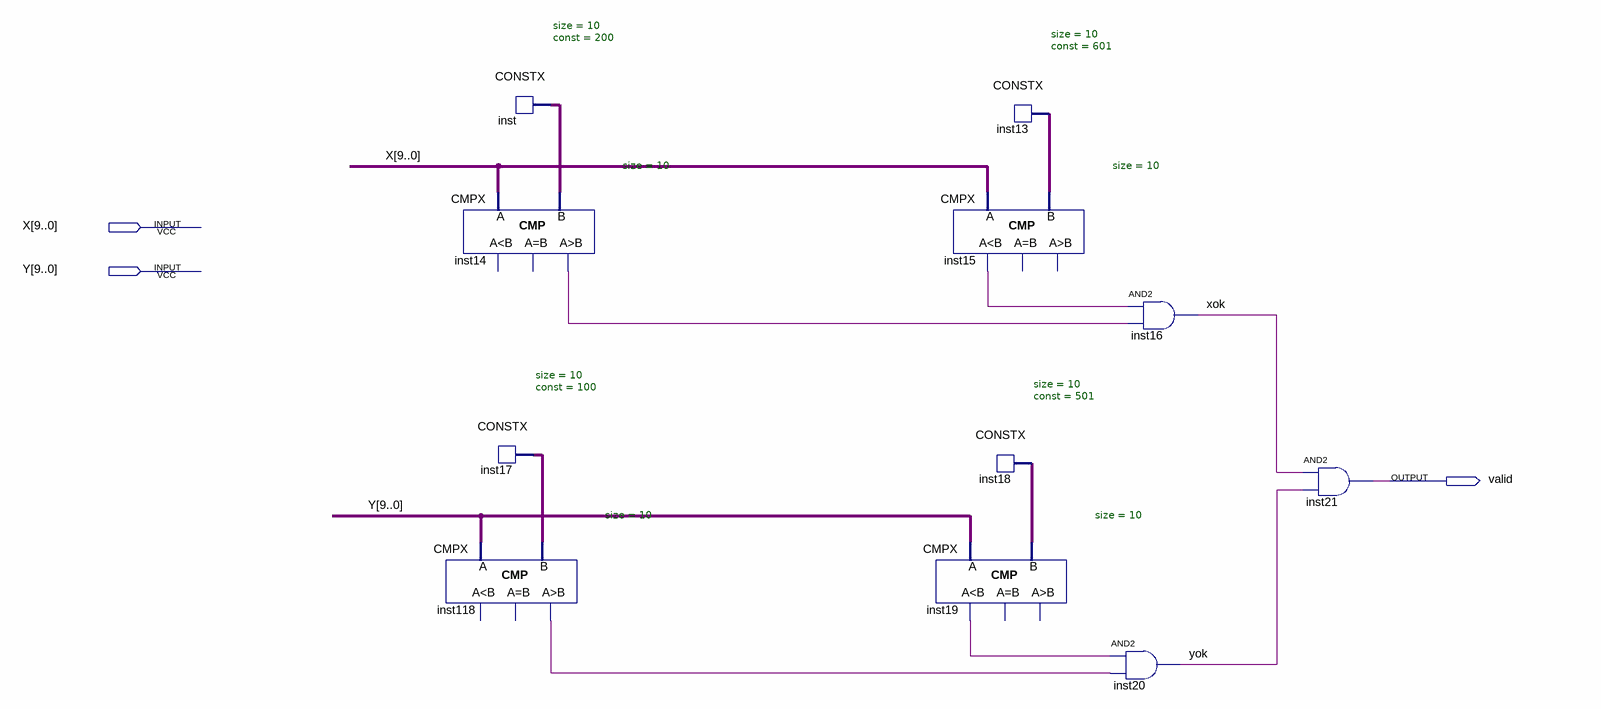
[diagram p0: schematic sheet]
// Quartus schematic UnutrasnjiKvadrat.bdf as structural Verilog: 11 symbols, 3 pins
module UnutrasnjiKvadrat (
  input  [9:0] X,
  input  [9:0] Y,
  output valid
);

  wire inst14_gr, inst15_ls, inst19_ls, inst118_gr, xok, yok;
  wire [9:0] inst13_data, inst17_data, inst18_data, inst_data;

  CONSTX #(.size(10), .\const (200)) inst (.data(inst_data));
  CMPX #(.size(10)) inst14 (.A(X), .B(inst_data), .gr(inst14_gr));  // open: ls, eq
  CONSTX #(.size(10), .\const (100)) inst17 (.data(inst17_data));
  CMPX #(.size(10)) inst118 (.A(Y), .B(inst17_data), .gr(inst118_gr));  // open: ls, eq
  CMPX #(.size(10)) inst15 (.A(X), .B(inst13_data), .ls(inst15_ls));  // open: eq, gr
  CONSTX #(.size(10), .\const (501)) inst18 (.data(inst18_data));
  CMPX #(.size(10)) inst19 (.A(Y), .B(inst18_data), .ls(inst19_ls));  // open: eq, gr
  CONSTX #(.size(10), .\const (601)) inst13 (.data(inst13_data));
  and inst20 (yok, inst19_ls, inst118_gr);
  and inst16 (xok, inst15_ls, inst14_gr);
  and inst21 (valid, xok, yok);
endmodule
